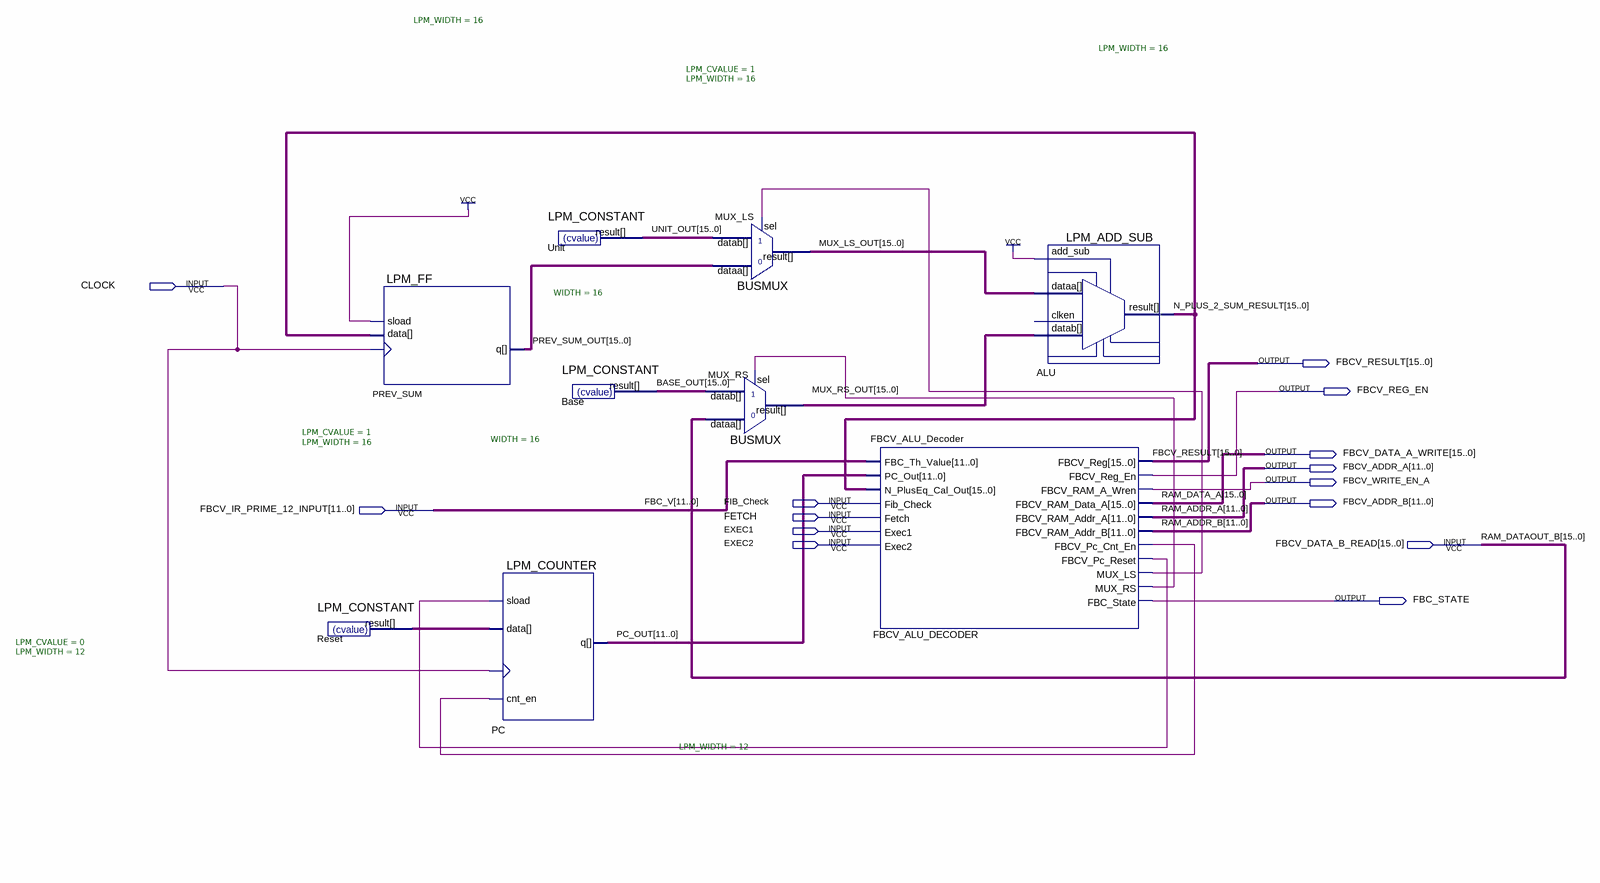
[diagram p0: schematic sheet]
// Quartus schematic FBCV_Project_V1.bdf as structural Verilog: 9 symbols, 14 pins
module FBCV_Project_V1 (
  input  CLOCK,
  input  FIB_Check,
  input  [11:0] FBCV_IR_PRIME_12_INPUT,
  input  FETCH,
  input  EXEC1,
  input  EXEC2,
  input  [15:0] FBCV_DATA_B_READ,
  output [15:0] FBCV_RESULT,
  output FBCV_REG_EN,
  output [15:0] FBCV_DATA_A_WRITE,
  output [11:0] FBCV_ADDR_A,
  output FBCV_WRITE_EN_A,
  output [11:0] FBCV_ADDR_B,
  output FBC_STATE
);

  wire FBCV_ALU_DECODER_fbcv_pc_cnt_en, FBCV_ALU_DECODER_fbcv_pc_reset, FBCV_ALU_DECODER_mux_ls,
       FBCV_ALU_DECODER_mux_rs;
  wire [11:0] PC_OUT, Reset_result;
  wire [15:0] BASE_OUT, MUX_LS_OUT, MUX_RS_OUT, N_PLUS_2_SUM_RESULT, PREV_SUM_OUT, UNIT_OUT;

  LPM_CONSTANT #(.LPM_CVALUE(0), .LPM_WIDTH(12)) Reset (.result(Reset_result));
  LPM_FF #(.LPM_WIDTH(16)) PREV_SUM (.clock(CLOCK), .data(N_PLUS_2_SUM_RESULT), .sload(1'b1), .q(PREV_SUM_OUT));
  LPM_COUNTER #(.LPM_WIDTH(12)) PC (
    .clock(CLOCK), .cnt_en(FBCV_ALU_DECODER_fbcv_pc_cnt_en), .data(Reset_result),
    .sload(FBCV_ALU_DECODER_fbcv_pc_reset), .q(PC_OUT));
  LPM_CONSTANT #(.LPM_CVALUE(1), .LPM_WIDTH(16)) Unit (.result(UNIT_OUT));
  LPM_CONSTANT #(.LPM_CVALUE(1), .LPM_WIDTH(16)) Base (.result(BASE_OUT));
  BUSMUX #(.WIDTH(16)) MUX_LS (
    .datab(UNIT_OUT), .sel(FBCV_ALU_DECODER_mux_ls), .dataa(PREV_SUM_OUT), .result(MUX_LS_OUT));
  BUSMUX #(.WIDTH(16)) MUX_RS (
    .datab(BASE_OUT), .sel(FBCV_ALU_DECODER_mux_rs), .dataa(FBCV_DATA_B_READ), .result(MUX_RS_OUT));
  FBCV_ALU_Decoder FBCV_ALU_DECODER (
    .FBC_Th_Value(FBCV_IR_PRIME_12_INPUT), .PC_Out(PC_OUT), .N_PlusEq_Cal_Out(N_PLUS_2_SUM_RESULT),
    .Fib_Check(FIB_Check), .Fetch(FETCH), .Exec1(EXEC1), .Exec2(EXEC2), .FBCV_Reg(FBCV_RESULT),
    .FBCV_Reg_En(FBCV_REG_EN), .FBCV_RAM_A_Wren(FBCV_WRITE_EN_A), .FBCV_RAM_Data_A(FBCV_DATA_A_WRITE),
    .FBCV_RAM_Addr_A(FBCV_ADDR_A), .FBCV_RAM_Addr_B(FBCV_ADDR_B),
    .FBCV_Pc_Cnt_En(FBCV_ALU_DECODER_fbcv_pc_cnt_en), .FBCV_Pc_Reset(FBCV_ALU_DECODER_fbcv_pc_reset),
    .MUX_LS(FBCV_ALU_DECODER_mux_ls), .MUX_RS(FBCV_ALU_DECODER_mux_rs), .FBC_State(FBC_STATE));
  LPM_ADD_SUB #(.LPM_WIDTH(16)) ALU (
    .add_sub(1'b1), .dataa(MUX_LS_OUT), .datab(MUX_RS_OUT), .result(N_PLUS_2_SUM_RESULT));  // open: clken

  // Other names for the same wires on the sheet: FBC_V[11:0] = FBCV_IR_PRIME_12_INPUT; RAM_ADDR_A[11:0] = FBCV_ADDR_A;
  //   RAM_ADDR_B[11:0] = FBCV_ADDR_B; RAM_DATA_A[15:0] = FBCV_DATA_A_WRITE; RAM_DATAOUT_B[15:0] = FBCV_DATA_B_READ
endmodule
